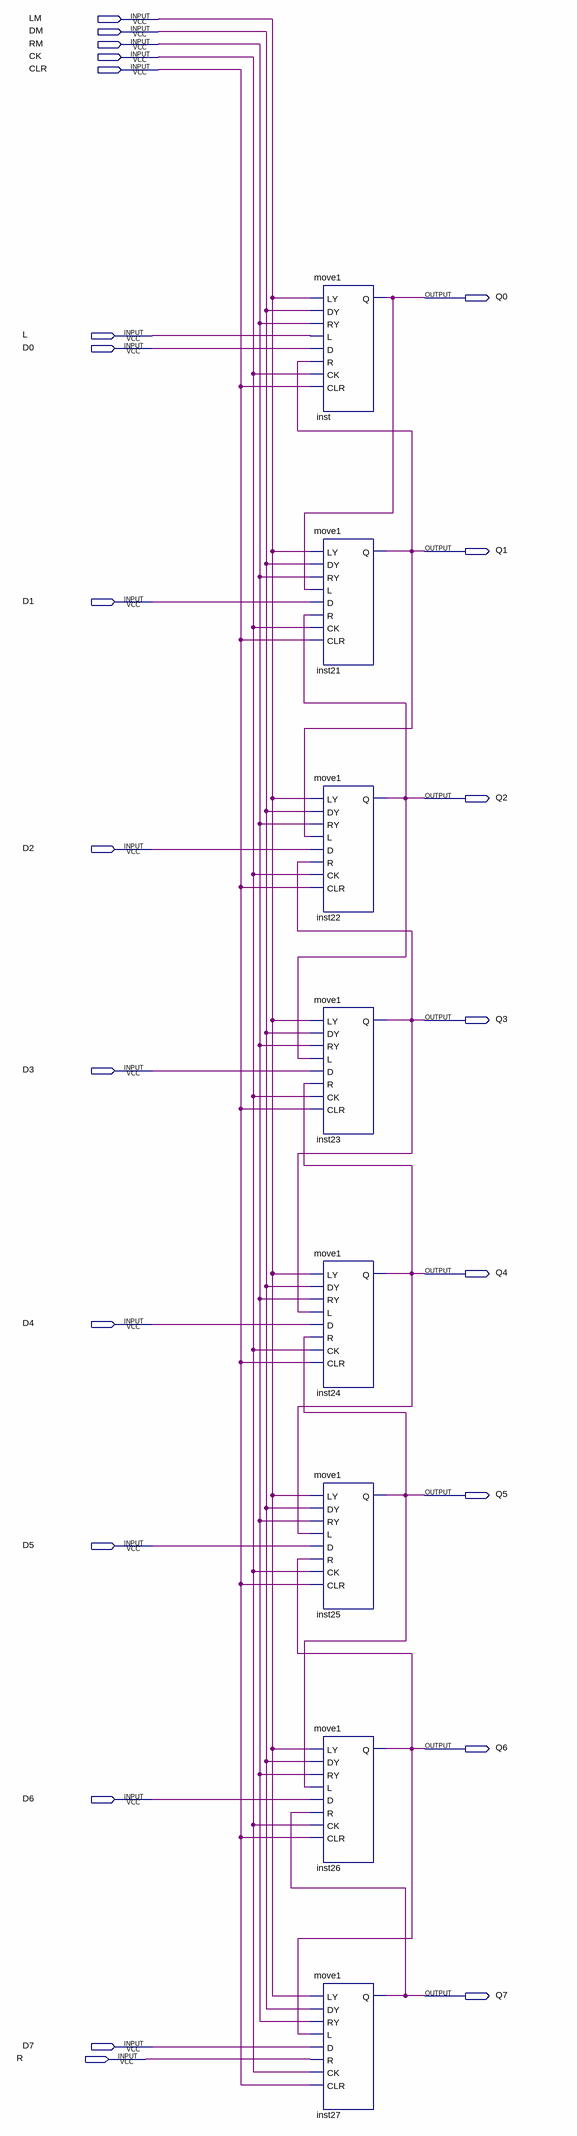
[diagram p0: schematic sheet]
// Quartus schematic move8.bdf as structural Verilog: 8 symbols, 23 pins
module move8 (
  input  LM,
  input  DM,
  input  RM,
  input  CK,
  input  CLR,
  input  L,
  input  D0,
  input  D1,
  input  D2,
  input  D3,
  input  D4,
  input  D5,
  input  D6,
  input  D7,
  input  R,
  output Q0,
  output Q1,
  output Q2,
  output Q3,
  output Q4,
  output Q5,
  output Q6,
  output Q7
);

  move1 inst (.LY(LM), .DY(DM), .RY(RM), .L(L), .D(D0), .R(Q1), .CK(CK), .CLR(CLR), .Q(Q0));
  move1 inst21 (.LY(LM), .DY(DM), .RY(RM), .L(Q0), .D(D1), .R(Q2), .CK(CK), .CLR(CLR), .Q(Q1));
  move1 inst22 (.LY(LM), .DY(DM), .RY(RM), .L(Q1), .D(D2), .R(Q3), .CK(CK), .CLR(CLR), .Q(Q2));
  move1 inst23 (.LY(LM), .DY(DM), .RY(RM), .L(Q2), .D(D3), .R(Q4), .CK(CK), .CLR(CLR), .Q(Q3));
  move1 inst24 (.LY(LM), .DY(DM), .RY(RM), .L(Q3), .D(D4), .R(Q5), .CK(CK), .CLR(CLR), .Q(Q4));
  move1 inst25 (.LY(LM), .DY(DM), .RY(RM), .L(Q4), .D(D5), .R(Q6), .CK(CK), .CLR(CLR), .Q(Q5));
  move1 inst26 (.LY(LM), .DY(DM), .RY(RM), .L(Q5), .D(D6), .R(Q7), .CK(CK), .CLR(CLR), .Q(Q6));
  move1 inst27 (.LY(LM), .DY(DM), .RY(RM), .L(Q6), .D(D7), .R(R), .CK(CK), .CLR(CLR), .Q(Q7));
endmodule
